# Altium schematic sheet STM32_ADTDA.SchDoc
size A3
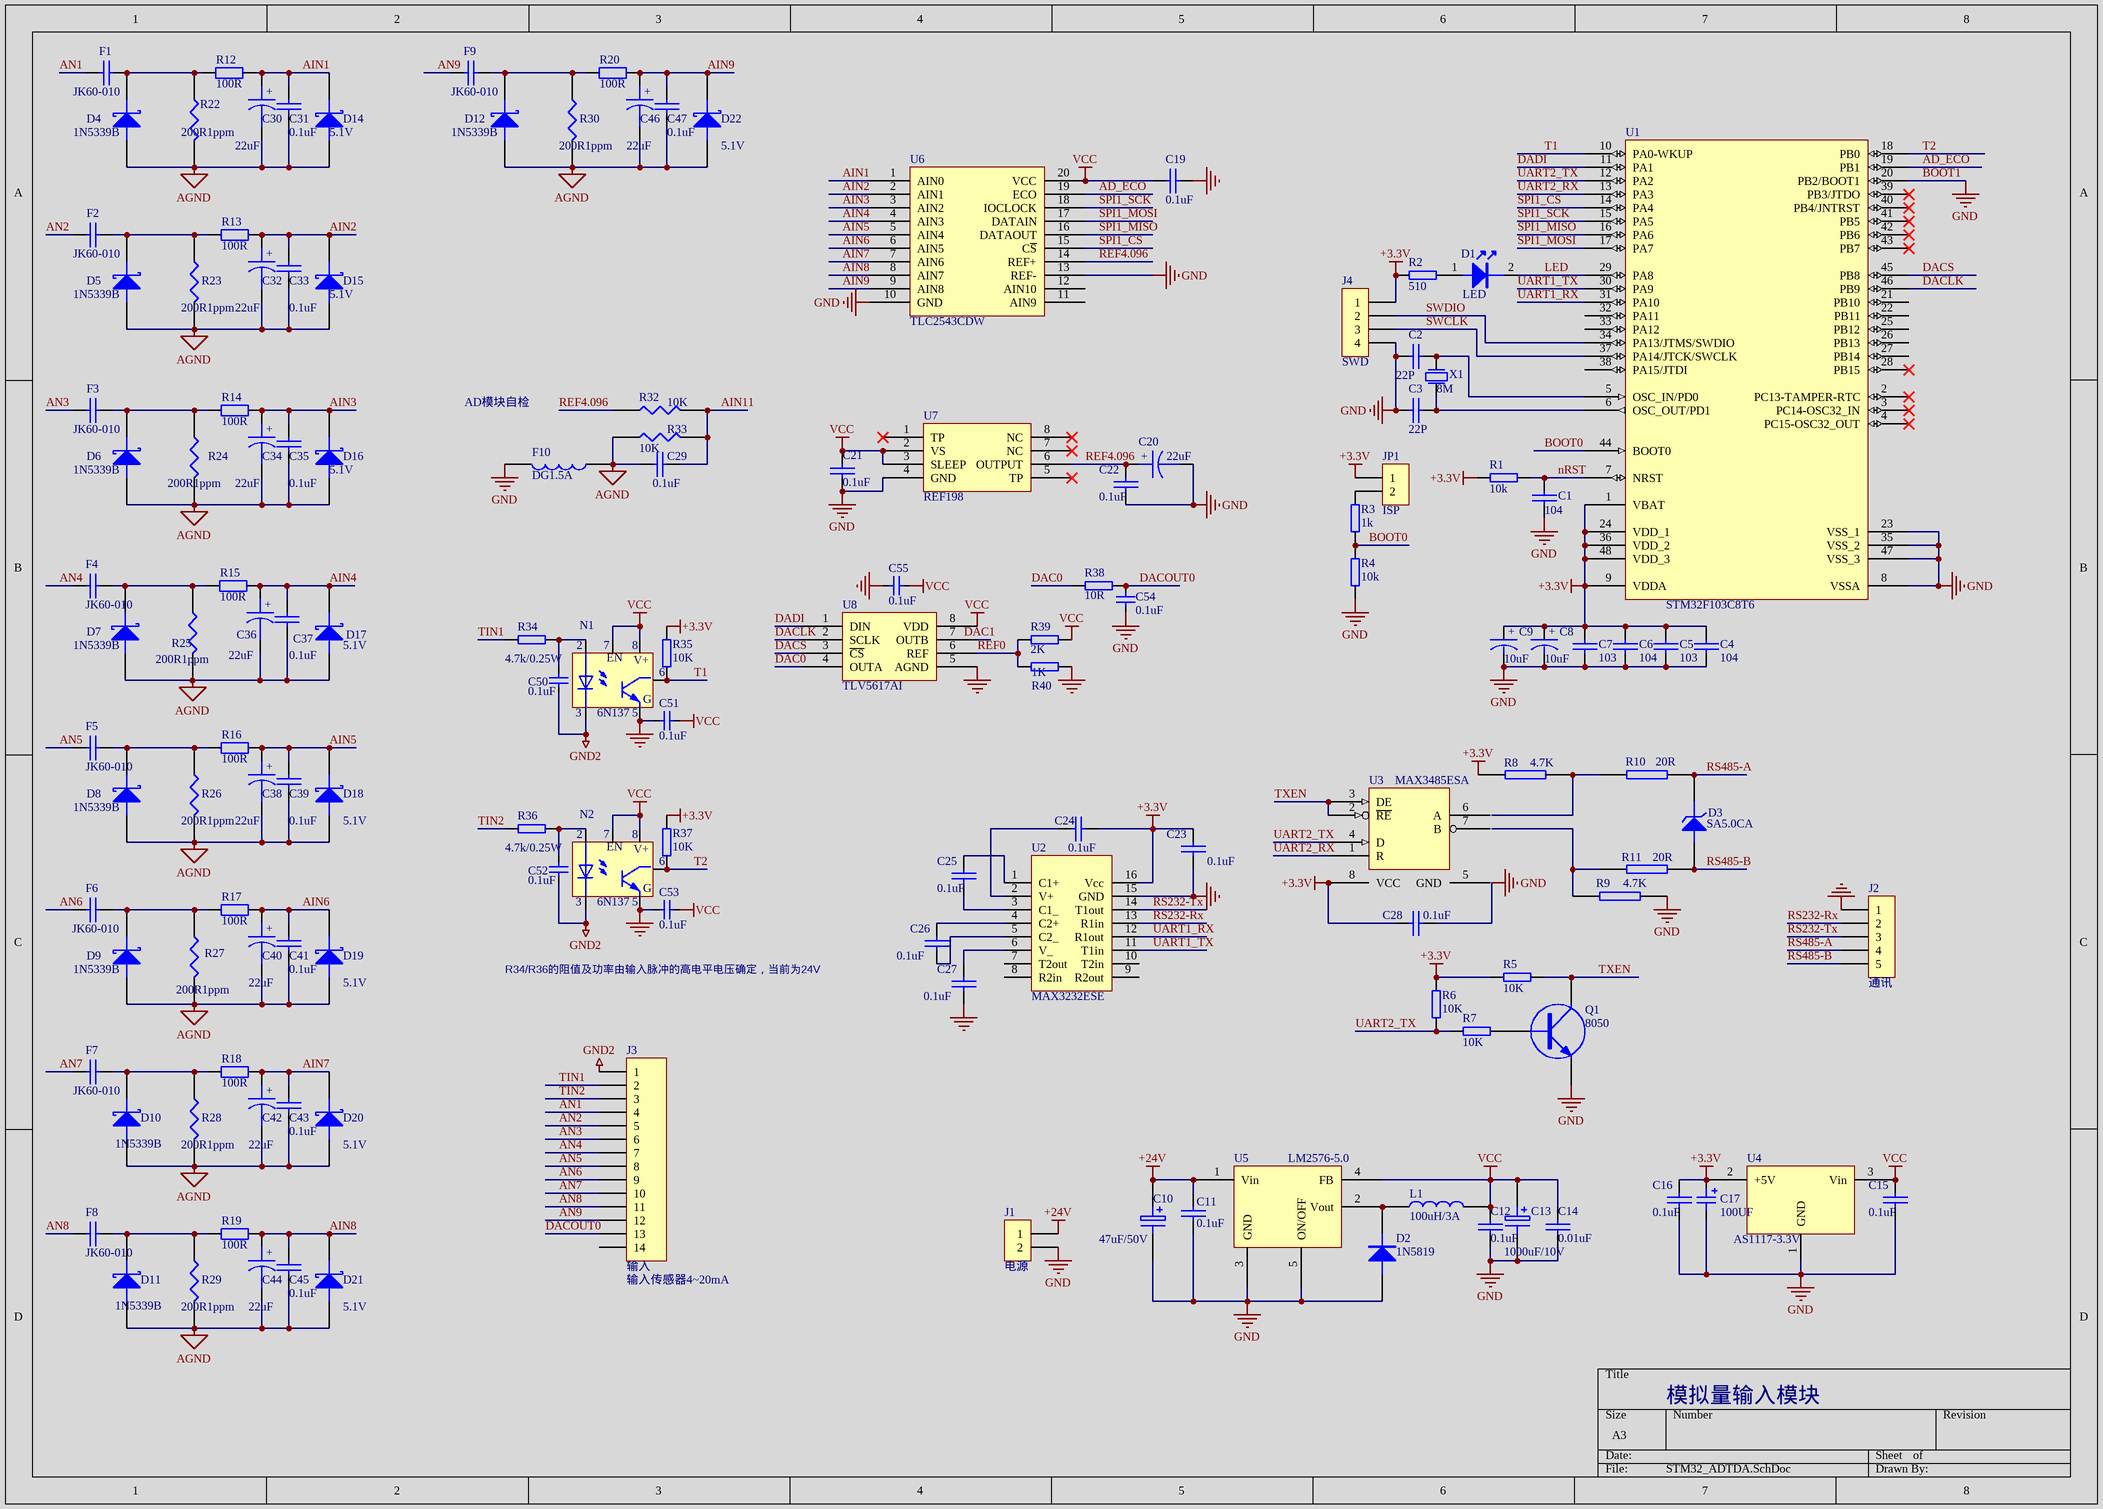
[diagram p0: STM32_ADTDA.SchDoc]

## Parts
C1  104  [0805]
C2  22P  [0805]
C3  22P  [0805]
C4  104  [0805]
C5  103  [0805]
C6  104  [0805]
C7  103  [0805]
C8  10uF  [1210(+)]
C9  10uF  [1210(+)]
C10  47uF/50V  [ROND-0.2]
C11  0.1uF  [0805]
C12  0.1uF  [0805]
C13  1000uF/10V  [DR10*10]
C14  0.01uF  [0805]
C15  0.1uF  [0805]
C16  0.1uF  [0805]
C17  100UF  [2220-1]
C19  0.1uF  [0805]
C20  22uF  [1210(+)]
C21  0.1uF  [0805]
C22  0.1uF  [0805]
C23  0.1uF  [0805]
C24  0.1uF  [0805]
C25  0.1uF  [0805]
C26  0.1uF  [0805]
C27  0.1uF  [0805]
C28  0.1uF  [0805]
C29  0.1uF  [0805]
C30  22uF  [1210(+)]
C31  0.1uF  [0805]
C32  22uF  [1210(+)]
C33  0.1uF  [0805]
C34  22uF  [1210(+)]
C35  0.1uF  [0805]
C36  22uF  [1210(+)]
C37  0.1uF  [0805]
C38  22uF  [1210(+)]
C39  0.1uF  [0805]
C40  22uF  [1210(+)]
C41  0.1uF  [0805]
C42  22uF  [1210(+)]
C43  0.1uF  [0805]
C44  22uF  [1210(+)]
C45  0.1uF  [0805]
C46  22uF  [1210(+)]
C47  0.1uF  [0805]
C50  0.1uF  [0805]
C51  0.1uF  [0805]
C52  0.1uF  [0805]
C53  0.1uF  [0805]
C54  0.1uF  [0805]
C55  0.1uF  [0805]
D1  LED  [ROND-0.2]
D2  1N5819  [DIODE-2]
D3  SA5.0CA  [CON2_4A7]
D4  1N5339B  [DIODE-0.3]
D5  1N5339B  [DIODE-0.3]
D6  1N5339B  [DIODE-0.3]
D7  1N5339B  [DIODE-0.3]
D8  1N5339B  [DIODE-0.3]
D9  1N5339B  [DIODE-0.3]
D10  1N5339B  [DIODE-0.3]
D11  1N5339B  [DIODE-0.3]
D12  1N5339B  [DIODE-0.3]
D14  5.1V  [DIDO]
D15  5.1V  [DIDO]
D16  5.1V  [DIDO]
D17  5.1V  [DIDO]
D18  5.1V  [DIDO]
D19  5.1V  [DIDO]
D20  5.1V  [DIDO]
D21  5.1V  [DIDO]
D22  5.1V  [DIDO]
F1  JK60-010  [RAD0.1]
F2  JK60-010  [RAD0.1]
F3  JK60-010  [RAD0.1]
F4  JK60-010  [RAD0.1]
F5  JK60-010  [RAD0.1]
F6  JK60-010  [RAD0.1]
F7  JK60-010  [RAD0.1]
F8  JK60-010  [RAD0.1]
F9  JK60-010  [RAD0.1]
F10  DG1.5A  [0805]
J1  电源  [CON2_5.08]
J2  通讯  [CON5_5.08]
J3  输入
J4  SWD  [CON4_2]
JP1  ISP  [CON2_2]
L1  100uH/3A  [DIANGAN1.5A]
N1  6N137  [DIP8]
N2  6N137  [DIP8]
Q1  8050  [sot-23]
R1  10k  [0805]
R2  510  [0805]
R3  1k  [0805]
R4  10k  [0805]
R5  10K  [0805]
R6  10K  [0805]
R7  10K  [0805]
R8  4.7K  [0805]
R9  4.7K  [0805]
R10  20R  [0805]
R11  20R  [0805]
R12  100R  [0805]
R13  100R  [0805]
R14  100R  [0805]
R15  100R  [0805]
R16  100R  [0805]
R17  100R  [0805]
R18  100R  [0805]
R19  100R  [0805]
R20  100R  [0805]
R22  200R1ppm  [axial0.3]
R23  200R1ppm  [axial0.3]
R24  200R1ppm  [axial0.3]
R25  200R1ppm  [axial0.3]
R26  200R1ppm  [axial0.3]
R27  200R1ppm  [axial0.3]
R28  200R1ppm  [axial0.3]
R29  200R1ppm  [axial0.3]
R30  200R1ppm  [axial0.3]
R32  10K  [0805]
R33  10K  [0805]
R34  4.7k/0.25W  [1206]
R35  10K  [0805]
R36  4.7k/0.25W  [1206]
R37  10K  [0805]
R38  10R  [0805]
R39  2K  [0805]
R40  1K  [0805]
U1  STM32F103C8T6  [STM32F103C-48]
U2  MAX3232ESE  [SO-16]
U3  MAX3485ESA  [SO-8]
U4  AS1117-3.3V  [sot223]
U5  LM2576-5.0  [TO-220-5S]
U6  TLC2543CDW  [SOL-20]
U7  REF198  [SO-8]
U8  TLV5617AI  [SO-8]
X1  8M  [XATL-5MM]

## Nets
+3.3V: C4.1 C5.1 C6.1 C7.1 C8.1 C9.1 C12.1 C13.1 C14.2 C15.2 C16.2 C17.1 C19.1 C21.1 C23.1 C24.2 C28.1 C51.1 C53.1 C55.1 J4.1 JP1.1 L1.2 N1.7(EN) N1.8(VCC) N2.7(EN) N2.8(VCC) R1.1 R2.1 R5.1 R6.1 R8.2 R35.2 R37.2 R39.1 U1.1(VBAT) U1.9(VDDA) U1.24(VDD_1) U1.36(VDD_2) U1.48(VDD_3) U2.16(Vcc) U3.8(VCC) U4.2(+5V) U4.3(Vin) U5.4(FB) U6.20(VCC) U7.2(VS) U7.3(SLEEP) U8.8(VDD)  [also labelled VCC]
+24V: C10.1 C11.2 J1.1 U5.1(Vin)
AGND: C29.1 C30.2 C31.2 C32.2 C33.2 C34.2 C35.2 C36.2 C37.2 C38.2 C39.2 C40.2 C41.2 C42.2 C43.2 C44.2 C45.2 C46.2 C47.2 D4.1(A) D5.1(A) D6.1(A) D7.1(A) D8.1(A) D9.1(A) D10.1(A) D11.1(A) D12.1(A) D14.1(A) D15.1(A) D16.1(A) D17.1(A) D18.1(A) D19.1(A) D20.1(A) D21.1(A) D22.1(A) F10.1 R22.2 R23.2 R24.2 R25.2 R26.2 R27.2 R28.2 R29.2 R30.2 R33.1
BOOT1: C1.1 C2.1 C3.1 C4.2 C5.2 C6.2 C7.2 C8.2 C9.2 C10.2 C11.1 C12.2 C13.2 C14.1 C15.1 C16.1 C17.2 C19.2 C20.2 C21.2 C22.2 C23.2 C27.1 C28.2 C51.2 C53.2 C54.2 C55.2 D2.1(A) F10.2 J1.2 J2.1 J4.4 N1.5(GND) N2.5(GND) Q1.2(E) R4.2 R9.2 R40.1 U1.8(VSSA) U1.20(PB2/BOOT1) U1.23(VSS_1) U1.35(VSS_2) U1.47(VSS_3) U2.15(GND) U3.5(GND) U4.1(GND) U5.3(GND) U5.5(ON/OFF) U6.10(GND) U6.13(REF-) U7.4(GND) U8.5(AGND)  [also labelled GND]
GND2: C50.1 C52.1 J3.1 N1.3(K) N2.3(K)
AD_ECO: U1.19(PB1) U6.19(ECO)
AIN1: C30.1 C31.1 D14.2(K) R12.2 U6.1(AIN0)
AIN2: C32.1 C33.1 D15.2(K) R13.2 U6.2(AIN1)
AIN3: C34.1 C35.1 D16.2(K) R14.2 U6.3(AIN2)
AIN4: C36.1 C37.1 D17.2(K) R15.2 U6.4(AIN3)
AIN5: C38.1 C39.1 D18.2(K) R16.2 U6.5(AIN4)
AIN6: C40.1 C41.1 D19.2(K) R17.2 U6.6(AIN5)
AIN7: C42.1 C43.1 D20.2(K) R18.2 U6.7(AIN6)
AIN8: C44.1 C45.1 D21.2(K) R19.2 U6.8(AIN7)
AIN9: C46.1 C47.1 D22.2(K) R20.2 U6.9(AIN8)
AIN11: C29.2 R32.2 R33.2
AN1: F1.1 J3.4
AN2: F2.1 J3.5
AN3: F3.1 J3.6
AN4: F4.1 J3.7
AN5: F5.1 J3.8
AN6: F6.1 J3.9
AN7: F7.1 J3.10
AN8: F8.1 J3.11
AN9: F9.1 J3.12
BOOT0: R3.2 R4.1 U1.44(BOOT0)
DAC0: R38.2 U8.4(OUTA)
DACLK: U1.46(PB9) U8.2(SCLK)
DACOUT0: C54.1 J3.13 R38.1
DACS: U1.45(PB8) U8.3(~{CS})
DADI: U1.11(PA1) U8.1(DIN)
LED: D1.2(K) U1.29(PA8)
nRST: C1.2 R1.2 U1.7(NRST)
REF0: R39.2 R40.2 U8.6(REF)
REF4.096: C20.1 C22.1 R32.1 U6.14(REF+) U7.6(OUTPUT)
RS232-Rx: J2.2 U2.13(R1in)
RS232-Tx: J2.3 U2.14(T1out)
RS485-A: D3.2(K) J2.4 R10.2
RS485-B: D3.1(A) J2.5 R11.2
SPI1_CS: U1.14(PA4) U6.15(C~{S})
SPI1_MISO: U1.16(PA6) U6.16(DATAOUT)
SPI1_MOSI: U1.17(PA7) U6.17(DATAIN)
SPI1_SCK: U1.15(PA5) U6.18(IOCLOCK)
SWCLK: J4.3 U1.37(PA14/JTCK/SWCLK)
SWDIO: J4.2 U1.34(PA13/JTMS/SWDIO)
T1: N1.6(OUT) R35.1 U1.10(PA0-WKUP)
T2: N2.6(OUT) R37.1 U1.18(PB0)
TIN1: J3.2 R34.2
TIN2: J3.3 R36.2
TXEN: Q1.3(C) R5.2 U3.2(~{RE}) U3.3(DE)
UART1_RX: U1.31(PA10) U2.12(R1out)
UART1_TX: U1.30(PA9) U2.11(T1in)
UART2_RX: U1.13(PA3) U3.1(R)
UART2_TX: R6.2 R7.1 U1.12(PA2) U3.4(D)
NetC2_2: C2.2 U1.5(OSC_IN/PD0) X1.2(P2)
NetC3_2: C3.2 U1.6(OSC_OUT/PD1) X1.1(P1)
NetC24_1: C24.1 U2.2(V+)
NetC25_1: C25.1 U2.1(C1+)
NetC25_2: C25.2 U2.3(C1_)
NetC26_1: C26.1 U2.4(C2+)
NetC26_2: C26.2 U2.5(C2_)
NetC27_2: C27.2 U2.6(V_)
NetC50_2: C50.2 N1.2(A) R34.1
NetC52_2: C52.2 N2.2(A) R36.1
NetD1_1: D1.1(A) R2.2
NetD2_2: D2.2(K) L1.1 U5.2(Vout)
NetD4_2: D4.2(K) F1.2 R12.1 R22.1
NetD5_2: D5.2(K) F2.2 R13.1 R23.1
NetD6_2: D6.2(K) F3.2 R14.1 R24.1
NetD7_2: D7.2(K) F4.2 R15.1 R25.1
NetD8_2: D8.2(K) F5.2 R16.1 R26.1
NetD9_2: D9.2(K) F6.2 R17.1 R27.1
NetD10_2: D10.2(K) F7.2 R18.1 R28.1
NetD11_2: D11.2(K) F8.2 R19.1 R29.1
NetD12_2: D12.2(K) F9.2 R20.1 R30.1
NetJP1_2: JP1.2 R3.1
NetQ1_1: Q1.1(B) R7.2
NetR8_1: R8.1 R10.1
NetR9_1: R9.1 R11.1

Not connected (* = marked no-connect by the designer): J3 14; U1 2(PC13-TAMPER-RTC)* 3(PC14-OSC32_IN)* 4(PC15-OSC32_OUT)* 21(PB10) 22(PB11) 25(PB12) 26(PB13) 27(PB14) 28(PB15)* 32(PA11) 33(PA12) 38(PA15/JTDI) 39(PB3/JTDO)* 40(PB4/JNTRST)* 41(PB5)* 42(PB6)* 43(PB7)*; U2 7(T2out) 8(R2in) 9(R2out) 10(T2in); U3 6(A) 7(B); U6 11(AIN9) 12(AIN10); U7 1(TP)* 5(TP)* 7(NC)* 8(NC)*; U8 7(OUTB)

## Notes on the sheet
- AD模块自检
- R34/R36的阻值及功率由输入脉冲的高电平电压确定，当前为24V
- (near J3) 输入传感器4~20mA
- 模拟量输入模块
- Labels drawn without touching a wire or pin: DAC1
- (in symbol 6N137) V+; G
- (in symbol CAPACITOR POL) +
- (in symbol CAPACITOR POL_1) +

## Library data of the parts
C1-C7 C11 C12 C14-C16 C19 C21-C29 C31 C33 C35 C37 C39 C41 C43 C45 C47 F1-F9 = CAP: Capacitor
C8 C9 = CAPACITOR POL_1: Capacitor
C10 C13 = ELECTRO1: Electrolytic Capacitor
C17 = CD
C20 C30 C32 C34 C36 C38 C40 C42 C44 C46 = CAPACITOR POL: Capacitor
C50-C55 = C
D2 = DIODE
D3 = ZENER3: Zener Diode
D4-D12 D14-D22 = DIODE SCHOTTKY: Schottky Diode
F10 L1 = INDUCTOR1
J1 JP1 = CON2: Connector
J2 = CON5: Connector
J3 = CON14
J4 = CON4: Connector
Q1 = NPN: NPN Transistor
R1-R4 R6 R22-R30 R32 R33 = RES1
R5 R7 R34-R40 = R
R8-R11 = RES2
R12-R20 = Res2: Resistor; Published: *; LatestRevisionDate: *; LatestRevisionNote: *; PackageReference: *; Publisher: *; Value: *
U1 = STM32F101C8T6: STM32 ARM-based 32-bit MCU with 64 Kbytes Flash, 48-pin LQFP, Industrial Temperature; Published: *; DatasheetVersion: *; PackageVersion: *; PackageReference: *; Publisher: *; PackageDescription: *; ComponentLink1Description: *; ComponentLink1URL: *; ComponentLink2Description: *; ComponentLink2URL: *
U2 = CON16: Connector
U3 = DS36F95: DIFFERENTIAL BUS TRANSCEIVERS
U4 = MC79L05CG
U5 = LM2576
U6 = TCL2543
U7 = Component_1
U8 = TLV5617A
X1 = 12M: Crystal Oscillator